# EAGLE schematic WaveGlide2.0-Main (EAGLE 8.7.1)
DATABASE: ./BOM/WaveGlide2.0-BOM-mgr-WaveGlide2.0-PARTSDB.txt

## Sheet 1 of 2
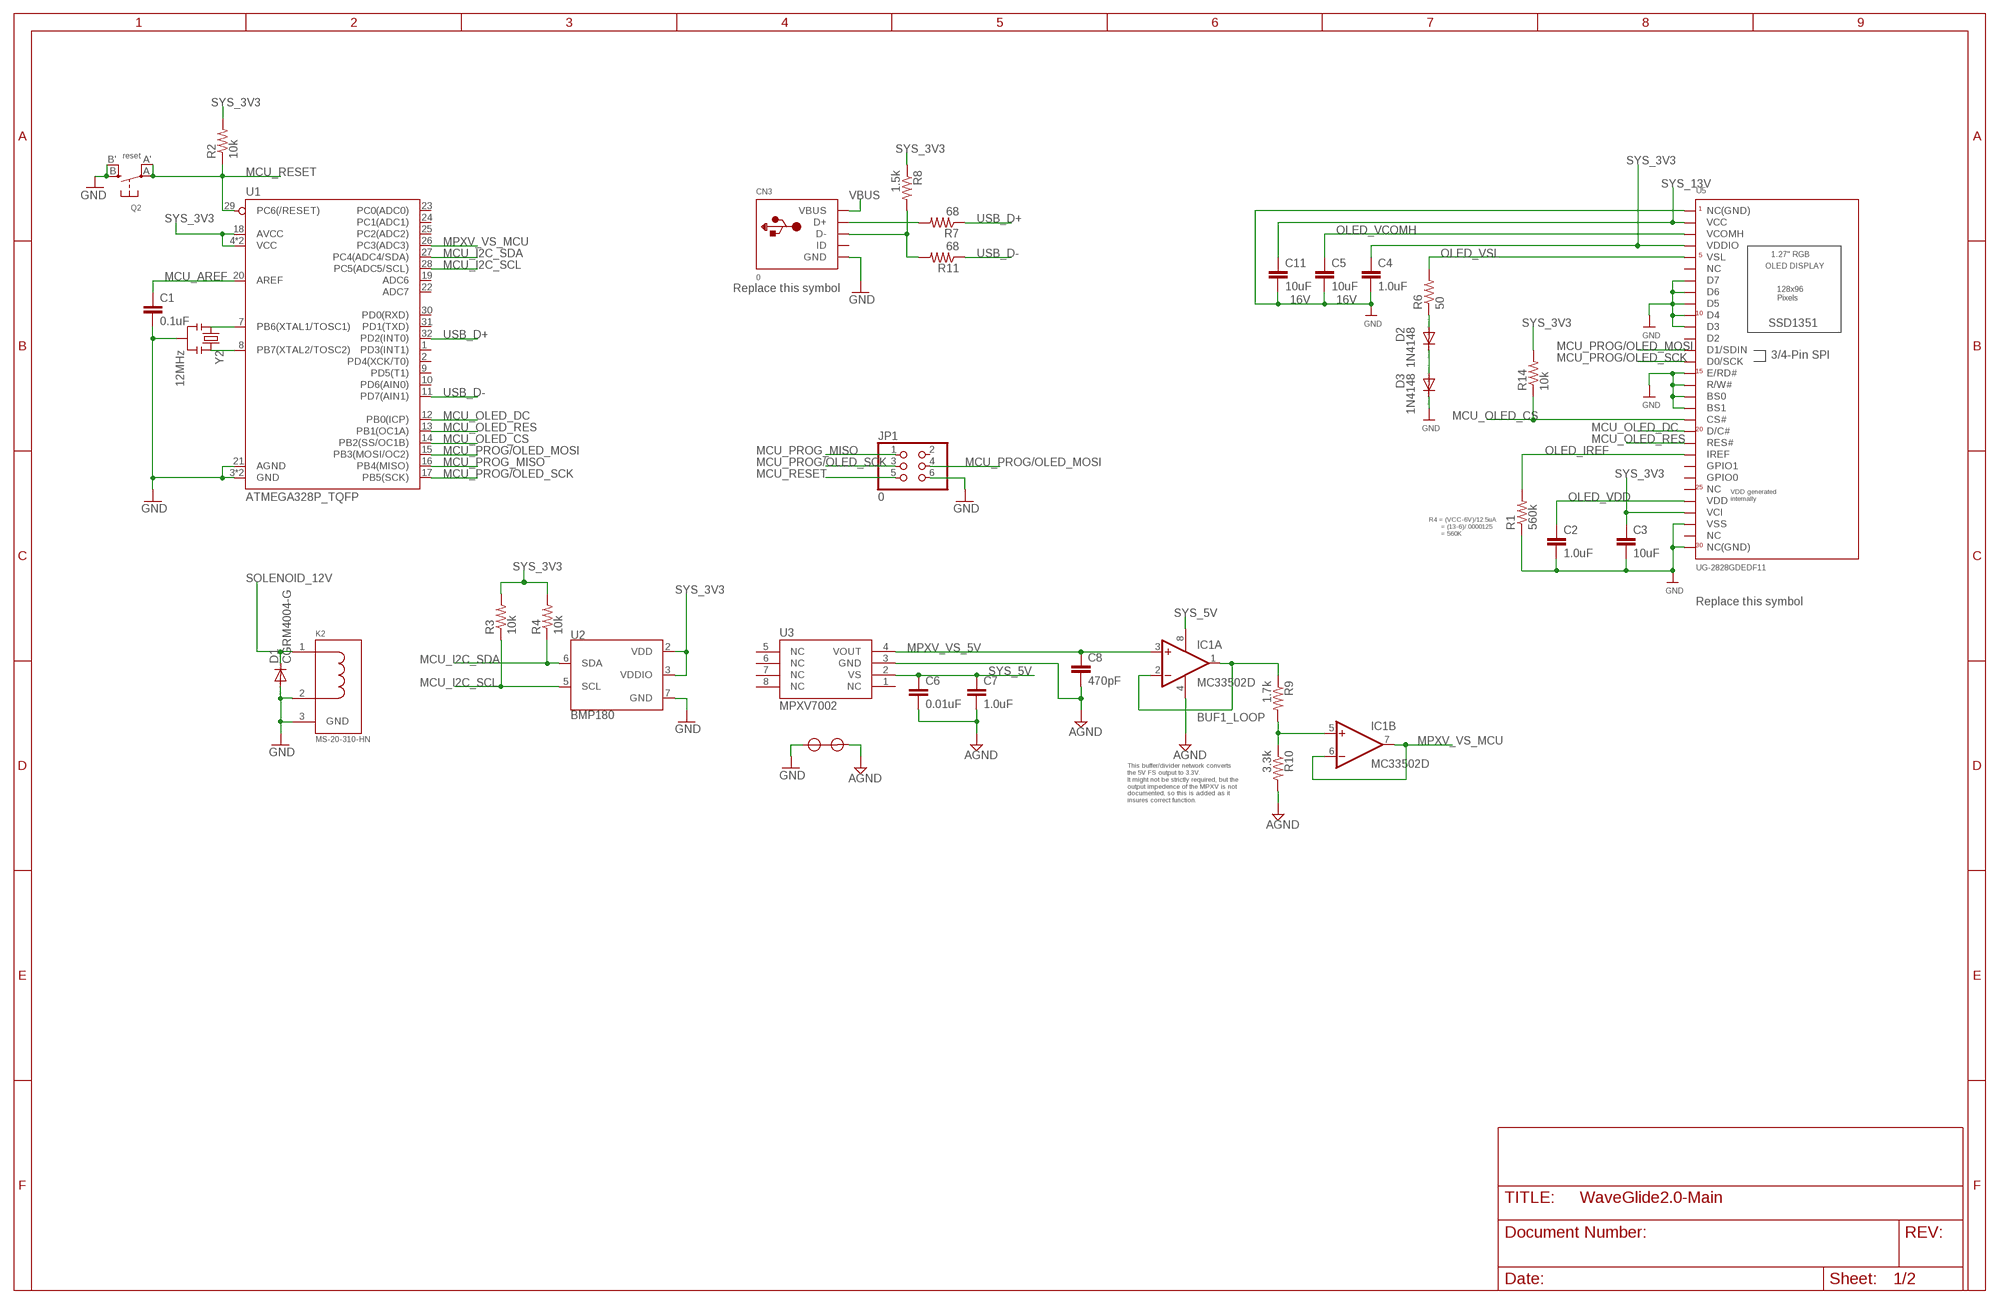
[diagram p0: schematic, sheet 1]

### Parts
C1  0.1uF  C-EUC0805  [C0805]
C2  1.0uF  C-EUC0805  [C0805]
C3  10uF  C-EUC0805  [C0805]
C4  1.0uF  C-EUC0805  [C0805]
C5  10uF  C-EUC0805  [C0805]
C6  0.01uF  C-EUC0805  [C0805]
C7  1.0uF  C-EUC0805  [C0805]
C8  470pF  C-EUC0805  [C0805]
C11  10uF  C-EUC0805  [C0805]
CN3  0  USBMICRO_20329  [4UCONN_20329]
D1  CGRM4004-G  [SOD-123_MINI-SMA]
D2  1N4148  DIODE-SOD323-W  [SOD323-W]
D3  1N4148  DIODE-SOD323-W  [SOD323-W]
IC1  MC33502D  MC33078D  [SO08]
JP1  0  PINHD-2X3  [2X03]
K2  MS-20-310-HN  [MS-20-310-HN]
Q2  reset  SWITCH_TACT_SMT4.6X2.8  [BTN_KMR2_4.6X2.8]
R1  560k  R-US_R0603  [R0603]
R2  10k  R-US_R0603  [R0603]
R3  10k  R-US_R0603  [R0603]
R4  10k  R-US_R0603  [R0603]
R6  50  R-US_R0603  [R0603]
R7  68  R-US_R0603  [R0603]
R8  1.5k  R-US_R0603  [R0603]
R9  1.7k  R-US_R0603  [R0603]
R10  3.3k  R-US_R0603  [R0603]
R11  68  R-US_R0603  [R0603]
R14  10k  R-US_R0603  [R0603]
U1  ATMEGA328P_TQFP  ATMEGA328P_TQFP32  [TQFP32-08]
U2  BMP180  [BMP180]
U3  MPXV7002  [MPXV7002]
U5  UG-2828GDEDF11  DISP_OLED_UG-2896GDEAF11TOP  [FPC_XF2M-3015-1A]
U$2  SHORT  [SHORT]
Y2  12MHz  RESONATORSMD  [RESONATOR-SMD]

### Nets
AGND: C6.2 C7.2 C8.2 IC1.4(P:V-) R10.2 U3.3(GND) U$2.P$2
BUF1_LOOP: IC1.1(A:OUT) IC1.2(A:-IN) R9.1
D+1: CN3.D+ R7.2
D-1: CN3.D- R8.2 R11.2
GND: C1.2 C2.2 C3.2 C4.2 C5.2 C11.2 CN3.BASE@1(GND) CN3.BASE@2(GND) CN3.GND CN3.SPRT@1(GND) CN3.SPRT@2(GND) CN3.SPRT@3(GND) CN3.SPRT@4(GND) D1.A D3.C JP1.6 K2.2(VR) K2.3(GND) Q2.B'(S1) Q2.B(S) R1.1 U1.3(GND) U1.5(GND) U1.21(AGND) U2.7(GND) U5.P$1(NC(GND)) U5.P$3(VSS) U5.P$13(BS1) U5.P$14(BS0) U5.P$15(R/W#) U5.P$16(E/RD#) U5.P$20(D3) U5.P$21(D4) U5.P$22(D5) U5.P$23(D6) U5.P$24(D7) U5.P$30(NC(GND)) U$2.P$1 Y2.2 ; also sheet 2
MCU_AREF: C1.1 U1.20(AREF)
MCU_I2C_SCL: R3.1 U1.28(PC5(ADC5/SCL)) U2.5(SCL)
MCU_I2C_SDA: R4.1 U1.27(PC4(ADC4/SDA)) U2.6(SDA)
MCU_OLED_CS: R14.1 U1.14(PB2(SS/OC1B)) U5.P$12(CS#)
MCU_OLED_DC: U1.12(PB0(ICP)) U5.P$11(D/C#)
MCU_OLED_RES: U1.13(PB1(OC1A)) U5.P$10(RES#)
MCU_PROG/OLED_MOSI: JP1.4 U1.15(PB3(MOSI/OC2)) U5.P$18(D1/SDIN)
MCU_PROG/OLED_SCK: JP1.3 U1.17(PB5(SCK)) U5.P$17(D0/SCK)
MCU_PROG_MISO: JP1.1 U1.16(PB4(MISO))
MCU_RESET: JP1.5 Q2.A'(P1) Q2.A(P) R2.1 U1.29(PC6(/RESET))
MPXV_VS_5V: C8.1 IC1.3(A:+IN) U3.4(VOUT)
MPXV_VS_MCU: IC1.6(B:-IN) IC1.7(B:OUT) U1.26(PC3(ADC3))
N$1: D2.C D3.A
N$2: D2.A R6.1
N$4: IC1.5(B:+IN) R9.2 R10.1
N$9: U1.7(PB6(XTAL1/TOSC1)) Y2.1
N$10: U1.8(PB7(XTAL2/TOSC2)) Y2.3
OLED_IREF: R1.2 U5.P$9(IREF)
OLED_VCOMH: C5.1 U5.P$28(VCOMH)
OLED_VDD: C2.1 U5.P$5(VDD)
OLED_VSL: R6.2 U5.P$26(VSL)
SOLENOID_12V: D1.C K2.1(VS) ; also sheet 2
SYS_3V3: C3.1 C4.1 R2.2 R3.2 R4.2 R8.1 R14.2 U1.4(VCC) U1.6(VCC) U1.18(AVCC) U2.2(VDD) U2.3(VDDIO) U5.P$4(VCI) U5.P$27(VDDIO) ; also sheet 2
SYS_5V: C6.1 C7.1 IC1.8(P:V+) U3.2(VS) ; also sheet 2
SYS_13V: C11.1 U5.P$29(VCC) ; also sheet 2
USB_D+: R7.1 U1.32(PD2(INT0))
USB_D-: R11.1 U1.11(PD7(AIN1))
VBUS: CN3.VBUS
Unconnected: CN3.ID JP1.2 U1.1(PD3(INT1)) U1.2(PD4(XCK/T0)) U1.9(PD5(T1)) U1.10(PD6(AIN0)) U1.19(ADC6) U1.22(ADC7) U1.23(PC0(ADC0)) U1.24(PC1(ADC1)) U1.25(PC2(ADC2)) U1.30(PD0(RXD)) U1.31(PD1(TXD)) U3.1(NC) U3.5(NC) U3.6(NC) U3.7(NC) U3.8(NC) U5.P$2(NC) U5.P$6(NC) U5.P$7(GPIO0) U5.P$8(GPIO1) U5.P$19(D2) U5.P$25(NC)

### Notes on the sheet
- Replace this symbol
- VDD generated
  internally
- R4 = (VCC-6V)/12.5uA
        = (13-6)/.0000125
        = 560K
- Replace this symbol
- This buffer/divider network converts 
  the 5V FS output to 3.3V.
  It might not be strictly required, but the
  output impedence of the MPXV is not
  documented, so this is added as it
  insures correct function.

## Sheet 2 of 2
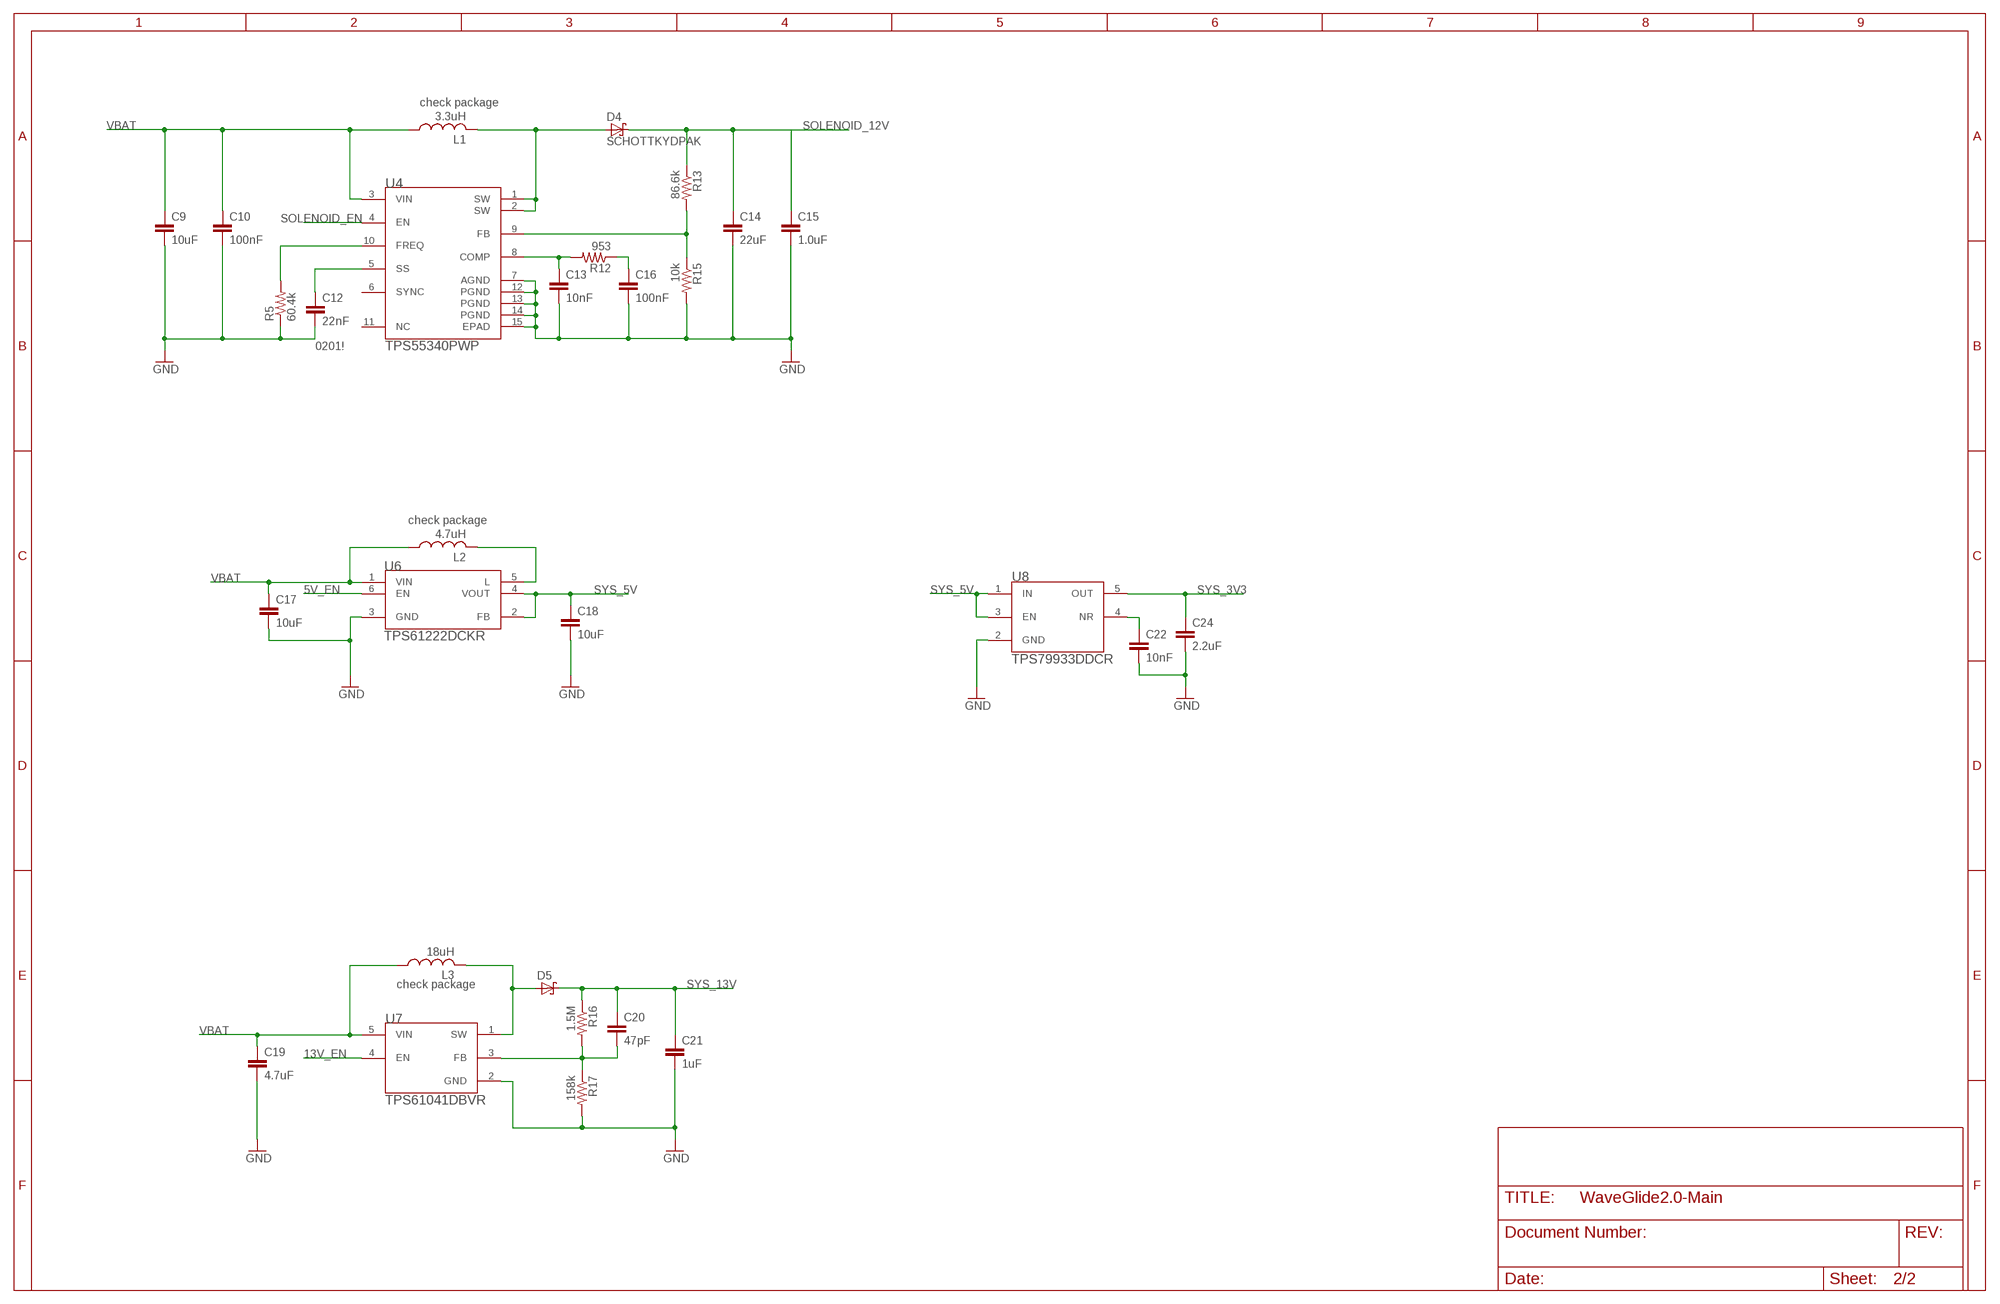
[diagram p1: schematic, sheet 2]

### Parts
C9  10uF  C-EUC0805  [C0805]
C10  100nF  C-EUC0805  [C0805]
C12  22nF  C-EUC0402  [C0402]
C13  10nF  C-EUC0805  [C0805]
C14  22uF  C-EUC1210  [C1210]
C15  1.0uF  C-EUC0805  [C0805]
C16  100nF  C-EUC0805  [C0805]
C17  10uF  C-EUC0805  [C0805]
C18  10uF  C-EUC0805  [C0805]
C19  4.7uF  C-EUC0603  [C0603]
C20  47pF  C-EUC0603  [C0603]
C21  1uF  C-EUC0805  [C0805]
C22  10nF  C-EUC0402  [C0402]
C24  2.2uF  C-EUC0402  [C0402]
D4  SCHOTTKYDPAK  [D-PAK_TO252AA]
D5  SCHOTTKYSOT-123  [SOD-123_MINI-SMA]
L1  3.3uH  L-USL4532P  [L4532P]
L2  4.7uH  L-USL4035M  [L4035M]
L3  18uH  L-USL4035M  [L4035M]
R5  60.4k  R-US_R0603  [R0603]
R12  953  R-US_R0603  [R0603]
R13  86.6k  R-US_R0603  [R0603]
R15  10k  R-US_R0805  [R0805]
R16  1.5M  R-US_R0603  [R0603]
R17  158k  R-US_R0603  [R0603]
U4  TPS55340PWP  [PWP14]
U6  TPS61222DCKR  [DCK6]
U7  TPS61041DBVR  [DBV5]
U8  TPS79933DDCR  [DDC5]

### Nets
5V_EN: U6.6(EN)
13V_EN: U7.4(EN)
GND: C9.2 C10.2 C12.2 C13.2 C14.2 C15.2 C16.2 C17.2 C18.2 C19.2 C21.2 C22.2 C24.2 R5.1 R15.2 R17.2 U4.7(AGND) U4.12(PGND) U4.13(PGND) U4.14(PGND) U4.15(EPAD) U6.3(GND) U7.2(GND) U8.2(GND) ; also sheet 1
N$5: D5.A L3.2 U7.1(SW)
SOLENOID_12V: C14.1 C15.1 D4.4(C) R13.1 ; also sheet 1
SOLENOID_EN: U4.4(EN)
SYS_3V3: C24.1 U8.5(OUT) ; also sheet 1
SYS_5V: C18.1 U6.2(FB) U6.4(VOUT) U8.1(IN) U8.3(EN) ; also sheet 1
SYS_13V: C20.1 C21.1 D5.C R16.1 ; also sheet 1
TPS55340_COMP: C13.1 R12.2 U4.8(COMP)
TPS55340_FB: R13.2 R15.1 U4.9(FB)
TPS55340_FB1: C20.2 R16.2 R17.1 U7.3(FB)
TPS55340_FREQ: R5.2 U4.10(FREQ)
TPS55340_SS: C12.1 U4.5(SS)
TPS55340_SW: D4.1(A) D4.3(A) L1.2 U4.1(SW) U4.2(SW)
TPS61222_L: L2.2 U6.5(L)
TPS66340_COMP1: C16.1 R12.1
TPS79933_NR: C22.1 U8.4(NR)
VBAT: C9.1 C10.1 C17.1 C19.1 L1.1 L2.1 L3.1 U4.3(VIN) U6.1(VIN) U7.5(VIN)
Unconnected: U4.6(SYNC) U4.11(NC)

### Notes on the sheet
- check package
- 0201!
- check package
- check package

## Library data of the parts
C1-C4 C6-C8 = resistor:C-EU: CAPACITOR, European symbol; POPULATE: 1
C5 C11 = resistor:C-EU: CAPACITOR, European symbol; POPULATE: 1; VOLT: 16V
C9 = resistor:C-EU: CAPACITOR, European symbol; MPN: GRM219R61A106KE44D; POPULATE: 1
C10 = resistor:C-EU: CAPACITOR, European symbol; MPN: CC0805KRX7R8BB104; POPULATE: 1
C12 = resistor:C-EU: CAPACITOR, European symbol; MPN: GRM155R60J223KA01D; POPULATE: 1; TOL: 10%; VOLT: 6.3V
C13 = resistor:C-EU: CAPACITOR, European symbol; MPN: GCM2195C1H103JA16D; POPULATE: 1
C14 = resistor:C-EU: CAPACITOR, European symbol; MPN: GRM32ER61C226ME20L; POPULATE: 1
C15 = resistor:C-EU: CAPACITOR, European symbol; MPN: EMK107B7105KA-T; POPULATE: 1
C16 = resistor:C-EU: CAPACITOR, European symbol; MPN: 08053C104JAZ2A; POPULATE: 1
C17 = resistor:C-EU: CAPACITOR, European symbol; MPN: GRM21BR60J106ME19L; POPULATE: 1; TOL: 20%; VOLT: 6.3V
C18 = resistor:C-EU: CAPACITOR, European symbol; MPN: C0805C106K8PACTU; POPULATE: 1; TOL: 10%; VOLT: 10V
C19 = resistor:C-EU: CAPACITOR, European symbol; MPN: GRM188R60J475KE19D; POPULATE: 1; TOL: 10%; VOLT: 6.3V
C20 = resistor:C-EU: CAPACITOR, European symbol; MPN: 06035A470KAT2A; POPULATE: 1; TOL: 10%; VOLT: 50V
C21 = resistor:C-EU: CAPACITOR, European symbol; MPN: GMK212B7105KG; POPULATE: 1; TOL: 10%; VOLT: 35V
C22 = resistor:C-EU: CAPACITOR, European symbol; MPN: GRM033R70J103KA01D; POPULATE: 1; TOL: 10%; VOLT: 6.3V
C24 = resistor:C-EU: CAPACITOR, European symbol; MPN: JMK105BJ225MV-F; POPULATE: 1; TOL: 20%; VOLT: 6.3V
CN3 = microbuilder:USB: USB Connectors USBMINIB - Surface Mount Female Mini-B USB Connector 4UConnector: 06564; POPULATE: 1
D1 = diode:CGRM400*-G: Molded plasitc,JEDEC SOD-123/Mini SMA Source: Comchip CGRM4001-G.pdf; POPULATE: 1
D2 = diode:DIODE-: DIODE; MPN: MBRD835LT4G; POPULATE: 1
D3 = diode:DIODE-: DIODE; POPULATE: 1
D4 D5 = CustomParts:SCHOTTKY
IC1 = linear:MC33078: OP AMP; POPULATE: 1
JP1 = pinhead:PINHD-2X3: PIN HEADER; POPULATE: 1
K2 = CustomParts:MS-20-310-HN; POPULATE: 1
L1 = resistor:L-US: INDUCTOR, American symbol; MPN: XAL5030-332MEB; POPULATE: 1; TOL: 20%
L2 = resistor:L-US: INDUCTOR, American symbol; MPN: LQM2HPN4R7MGCL; POPULATE: 1
L3 = resistor:L-US: INDUCTOR, American symbol; MPN: LPS4018-183MRB; POPULATE: 1; TOL: 20%
Q2 = microbuilder:SWITCH_TACT_SMT: SMT Tact Switches 6x6mm - Digikey: P12940SCT-ND KMR2 (4.6x2.8mm) - Digikey: 401-1426-1-ND EVQ-PQHB55 - Light Touch, 160GF (4.5x4.5mm) - Digikey: P8090SCT-ND KMT0 - KMT021 NGJ LHS (etc.) IP68/Waterproof - Digikey: CKN10289CT-ND; POPULATE: 1
R1-R4 R6-R8 R11 R14 = resistor:R-US_: RESISTOR, American symbol; POPULATE: 1
R5 = resistor:R-US_: RESISTOR, American symbol; MPN: CRCW060360K4FKEA; POPULATE: 1; TOL: 1%
R9 R10 = resistor:R-US_: RESISTOR, American symbol; POPULATE: 1; TOL: 1%
R12 = resistor:R-US_: RESISTOR, American symbol; MPN: CRCW0603953RFKEA; POPULATE: 1; TOL: 1%
R13 = resistor:R-US_: RESISTOR, American symbol; MPN: CRCW060386K6FKEA; POPULATE: 1; TOL: 1%
R15 = resistor:R-US_: RESISTOR, American symbol; MPN: RR1220P-103-D; POPULATE: 1; TOL: 0.5%
R16 = resistor:R-US_: RESISTOR, American symbol; MPN: CRCW06031M50FKEA; POPULATE: 1; TOL: 1%
R17 = resistor:R-US_: RESISTOR, American symbol; MPN: CRCW0603158KFKEA; POPULATE: 1
U1 = CustomParts:ATMEGA328P_TQFP32: Popular 328P in QFP Storefront component: ATmega328 - TQFP <https://www.sparkfun.com/products/13448> (COM-13448) Datasheet <http://www.sparkfun.com/datasheets/Components/SMD/ATMega328.pdf> SparkFun Products SparkFun RedBoard - Programmed with Arduino <https://www.sparkfun.com/products/12757> (DEV-12757) Arduino Pro Mini 328 - 5V/16MHz <https://www.sparkfun.com/products/11113> (DEV-11113) Arduino Pro Mini 328 - 3.3V/8MHz <https://www.sparkfun.com/products/11114> (DEV-11114) SparkFun OpenLog <https://www.sparkfun.com/products/13712> (DEV-13712) SparkFun MicroView - OLED Arduino Module <https://www.sparkfun.com/products/12923> (DEV-12923) SparkFun Digital Sandbox <https://www.sparkfun.com/products/12651> (DEV-12651) SparkFun PicoBoard <https://www.sparkfun.com/products/11888> (WIG-11888) Arduino Fio <https://www.sparkfun.com/products/10116> (DEV-10116) LilyPad Arduino 328 Main Board <https://www.sparkfun.com/products/13342> (DEV-13342) SparkFun RedStick <https://www.sparkfun.com/products/13741> (DEV-13741) LilyPad MP3 <https://www.sparkfun.com/products/11013> (DEV-11013) LilyPad Arduino SimpleSnap <https://www.sparkfun.com/products/10941> (DEV-10941) SparkFun Stepoko <https://www.sparkfun.com/products/13899> (ROB-13899) SparkFun Geiger Counter <https://www.sparkfun.com/products/11345> (SEN-11345) SparkFun EL Sequencer <https://www.sparkfun.com/products/12781> (COM-12781) Arduino Pro 328 - 5V/16MHz <https://www.sparkfun.com/products/10915> (DEV-10915) CryptoCape <https://www.sparkfun.com/products/12773> (DEV-12773) SparkFun IR Thermometer Evaluation Board - MLX90614 <https://www.sparkfun.com/products/10740> (SEN-10740) SparkFun RedBot Mainboard <https://www.sparkfun.com/products/12097> (ROB-12097) Arduino Pro 328 - 3.3V/8MHz <https://www.sparkfun.com/products/10914> (DEV-10914) SparkFun Block for Intel® Edison - Arduino <https://www.sparkfun.com/products/13036> (DEV-13036) SparkFun Simon Says - Surface Mount Soldering Kit <https://www.sparkfun.com/products/10935> (KIT-10935) SparkFun 7-Segment Serial Display - Red <https://www.sparkfun.com/products/11441> (COM-11441) SparkFun 7-Segment Serial Display - White <https://www.sparkfun.com/products/11629> (COM-11629) SparkFun 7-Segment Serial Display - Yellow <https://www.sparkfun.com/products/11443> (COM-11443) SparkFun 7-Segment Serial Display - Kelly Green <https://www.sparkfun.com/products/11440> (COM-11440) SparkFun 7-Segment Serial Display - Blue <https://www.sparkfun.com/products/11442> (COM-11442) SparkFun OpenSegment Serial Display - 20mm (Blue) <https://www.sparkfun.com/products/11647> (COM-11647) SparkFun OpenSegment Serial Display - 20mm (Green) <https://www.sparkfun.com/products/11646> (COM-11646) SparkFun OpenSegment Serial Display - 20mm (White) <https://www.sparkfun.com/products/11648> (COM-11648) SparkFun OpenSegment Serial Display - 20mm (Red) <https://www.sparkfun.com/products/11644> (COM-11644) SparkFun OpenSegment Serial Display - 20mm (Yellow) <https://www.sparkfun.com/products/11645> (COM-11645) SparkFun OpenSegment Shield <https://www.sparkfun.com/products/13190> (DEV-13190); MPN: TPS55340RTER; POPULATE: 1; PROD_ID: IC-09069
U2 = CustomParts:BMP180: Bosch BMP180 Digital Barometric Pressures Sensor The BMP180 is the function compatible successor of the BMP085, a new generation of high precision digital pressure sensors for consumer applications. The ultra-low power, low voltage electronics of the BMP180 is optimized for use in mobile phones, PDAs, GPS navigation devices and outdoor equipment. With a low altitude noise of merely 0.25m at fast conversion time, the BMP180 offers superior performance. The I2C interface allows for easy system integration with a microcontroller. The BMP180 is based on piezo-resistive technology for EMC robustness, high accuracy and linearity as well as long term stability. Web page: http://www.bosch-sensortec.com/en/homepage/products_3/environmental_sensors_1/bmp180_1/bmp180 Datasheet: http://ae-bst.resource.bosch.com/media/products/dokumente/bmp180/BST-BMP180-DS000-09.pdf SparkFun Products Barometric Pressure Sensor - BMP180 <https://www.sparkfun.com/products/11823> (COM-11823) SparkFun Barometric Pressure Sensor Breakout - BMP180 <https://www.sparkfun.com/products/11824> (SEN-11824); POPULATE: 1; PROD_ID: IC-11600; SF_ID: 11823
U3 = CustomParts:MPXV7002; POPULATE: 1
U4 = CustomParts:TPS55340PWP; MANUFACTURER_PART_NUMBER: TPS55340PWP; VENDOR: Texas Instruments
U5 = microbuilder:DISP_OLED_UG-2896GDEAF11: 128x96 1.27" RGB OLED - UG-2896GDEAF11 30-Pin 0.5mm Pitch FPC Cable (Top+Bottom Contacts) - OMRON XF2M-3015-1A (Digikey: OR723TR-ND) This FPC connector has contacts on the top and bottom, but the appropriate pin needs to be selected depending on whether the OLED will be inserted right-side up (use the TOP pinout) or upside-down (use the BOTTOM pinout).; POPULATE: 1
U6 = CustomParts:TPS61222DCKR; MANUFACTURER_PART_NUMBER: TPS61220DCKR; POPULATE: 1; VENDOR: Texas Instruments
U7 = CustomParts:TPS61041DBVR; MANUFACTURER_PART_NUMBER: TPS61041DBVR; VENDOR: Texas Instruments
U8 = CustomParts:TPS79933DDCR; MANUFACTURER_PART_NUMBER: TPS79933DDCR; VENDOR: Texas Instruments
U$2 = CustomParts:SHORT; BOM: EXCLUDE; POPULATE: 1
Y2 = SparkFun:RESONATOR: Resonator Small SMD resonator. This is the itty bitty 10/20MHz resonators with built in caps. CSTCE10M0G55 and CSTCE20M0V53. Footprint has been reviewed closely but hasn't been tested yet.; POPULATE: 1

## Net classes
1 power: width 0.305 mm